# Altium project buck&boost.PrjPCB
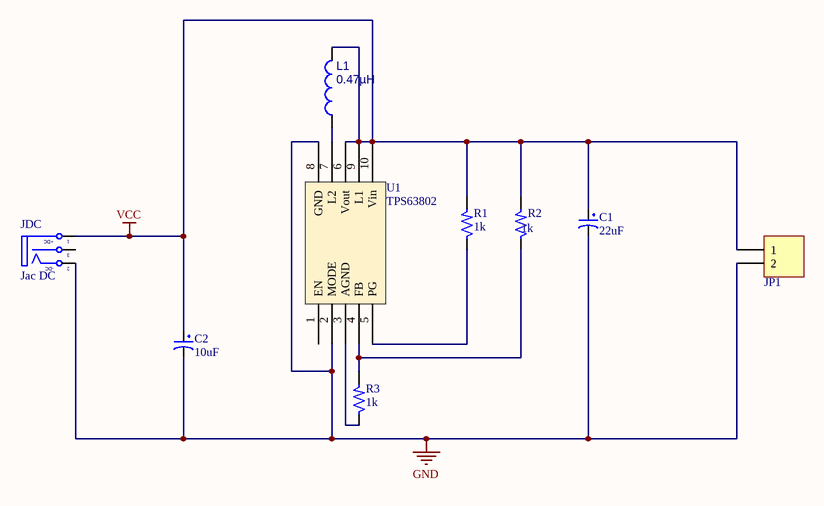
[diagram p0: Sheet_buck&boost.SchDoc]
1 sheet, 9 parts. Net scope: global (net labels, ports and power ports of the same name join across sheets).
Board file: buck&boost.PcbDoc

## Sheet Sheet_buck&boost.SchDoc
size A4

### Parts
C1  22uF  [CP1/2]
C2  10uF  [CP1/2]
JDC  Jac DC  [DC-IN]
JP1  Header 2_1  [HED2]  (value not drawn)
L1  0.47µH  [IND_COILCRAFT_LPS4018]
R1  1k  [SM-RES-1206]
R2  1k  [SM-RES-1206]
R3  1k  [SM-RES-1206]
U1  TPS63802  [TPS63802]

### Nets
GND: C1.2 C2.2 JDC.2(TN) JP1.2 U1.2(MODE) U1.8(GND)
VCC: C1.1 C2.1 JDC.1(T) JP1.1 L1.2 R1.2 R2.2 U1.6(Vout) U1.9(L1) U1.10(Vin)
NetL1_1: L1.1 U1.7(L2)
NetR1_1: R1.1 U1.5(PG)
NetR2_1: R2.1 R3.2 U1.4(FB)
NetR3_1: R3.1 U1.3(AGND)

Not connected (* = marked no-connect by the designer): JDC 3(S); U1 1(EN)

### Notes on the sheet
- (in symbol DCIN) +DC; -DC

### Library data of the parts
C1 C2 = CP1: Cap P  0,1uF < 22uF , 16 - 50V; Value: 10uF/50V; Description 1: 10 => 220uF/6,3V/10V - 10uF => 100uF/16V; Description 2: 0,1uF => 33uF/50V - 10uF => 22uF/63V; Description 3: 0,47uF => 10uF/100V
JDC = DCIN: Jac DC input; Value: Jac DC
JP1 = Header 2_1: Header, 2-Pin; Manufacturer: Generic Components; Class: Connector; Value: Header 2
L1 = INDC_120u_LPS4018: Inductor shielded 120uH 300mA LPS4018 SMD; Manufacturer 1: Coilcraft; Manufacturer Part Number 1: LPS4018-124ML; Ratings: 300 mArms; Tolerance: ±20%; Value: 120µ; Type: Ferrite Core; DC Resistance (DCR): 1.6 Ohm Max; Frequency - Self Resonant: 9MHz; Frequency - Test: 100kHz; Material - Core: Ferrite; SCDType: spec; Package / Case: LPS4018; Current: 300mA; Supplier 1: Coilcraft; Supplier Part Number 1: LPS4018-124MLC
R1-R3 = R: Resistor 1/4W; Value: R1/4W - 1K
U1 = TPS63802: SMD